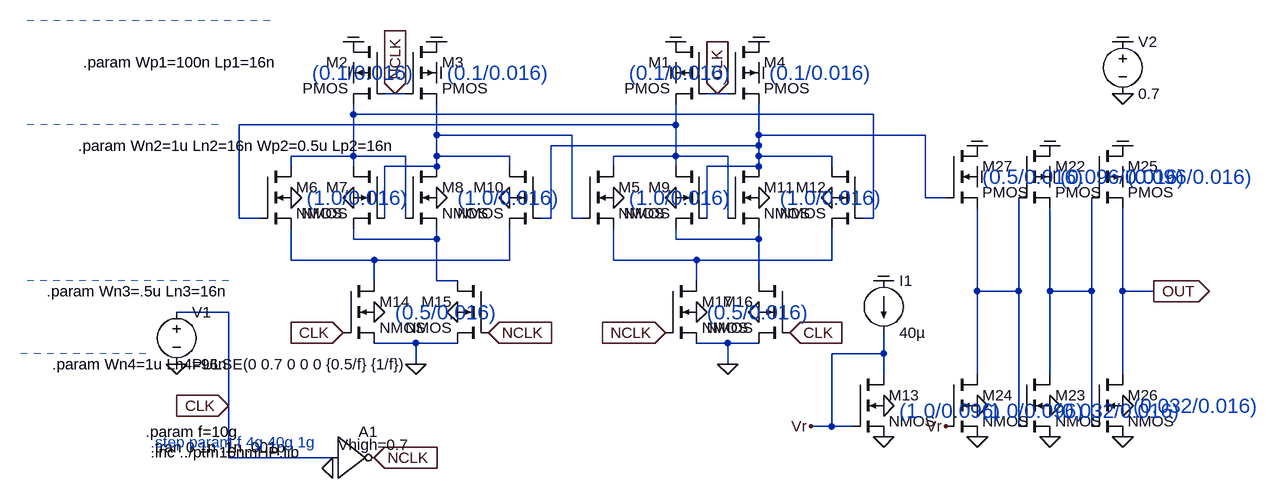
[diagram p0: schematic Wang_divide-by-2.asc]
Wang_divide-by-2.asc, the LTspice schematic file:
Version 4
SHEET 1 2320 1084
WIRE 1008 128 992 128
WIRE 1024 128 1008 128
WIRE 1504 128 1488 128
WIRE 1520 128 1504 128
WIRE 944 160 944 144
WIRE 1744 160 944 160
WIRE 1440 176 1440 144
WIRE 1440 176 768 176
WIRE 1072 192 1072 144
WIRE 1280 192 1072 192
WIRE 1568 192 1568 144
WIRE 1824 192 1568 192
WIRE 1568 208 1568 192
WIRE 1568 208 1248 208
WIRE 944 224 944 160
WIRE 944 224 848 224
WIRE 1024 224 944 224
WIRE 1072 224 1072 192
WIRE 1184 224 1072 224
WIRE 1440 224 1440 176
WIRE 1440 224 1344 224
WIRE 1520 224 1440 224
WIRE 1568 224 1568 208
WIRE 1680 224 1568 224
WIRE 848 240 848 224
WIRE 944 240 944 224
WIRE 1072 240 1072 224
WIRE 1072 240 992 240
WIRE 1184 240 1184 224
WIRE 1344 240 1344 224
WIRE 1440 240 1440 224
WIRE 1568 240 1568 224
WIRE 1568 240 1488 240
WIRE 1680 240 1680 224
WIRE 1824 288 1824 192
WIRE 1856 288 1824 288
WIRE 768 320 768 176
WIRE 800 320 768 320
WIRE 992 320 992 240
WIRE 1024 320 1024 224
WIRE 1248 320 1248 208
WIRE 1248 320 1232 320
WIRE 1280 320 1280 192
WIRE 1296 320 1280 320
WIRE 1488 320 1488 240
WIRE 1520 320 1520 224
WIRE 1744 320 1744 160
WIRE 1744 320 1728 320
WIRE 944 352 944 336
WIRE 1072 352 1072 336
WIRE 1072 352 944 352
WIRE 1440 352 1440 336
WIRE 1568 352 1568 336
WIRE 1568 352 1440 352
WIRE 848 384 848 336
WIRE 976 384 848 384
WIRE 1184 384 1184 336
WIRE 1184 384 976 384
WIRE 1344 384 1344 336
WIRE 1472 384 1344 384
WIRE 1680 384 1680 336
WIRE 1680 384 1472 384
WIRE 976 416 976 384
WIRE 1072 416 1072 352
WIRE 1104 416 1072 416
WIRE 1472 416 1472 384
WIRE 1568 416 1568 352
WIRE 1904 432 1904 304
WIRE 1968 432 1968 288
WIRE 1968 432 1904 432
WIRE 2016 432 2016 304
WIRE 2080 432 2080 288
WIRE 2080 432 2016 432
WIRE 2128 432 2128 304
WIRE 2176 432 2128 432
WIRE 752 464 672 464
WIRE 1040 512 976 512
WIRE 1104 512 1040 512
WIRE 1520 512 1472 512
WIRE 1568 512 1520 512
WIRE 1760 528 1760 496
WIRE 1760 528 1680 528
WIRE 1040 544 1040 512
WIRE 1520 544 1520 512
WIRE 1760 560 1760 528
WIRE 1904 560 1904 432
WIRE 2016 560 2016 432
WIRE 2128 560 2128 432
WIRE 752 608 752 464
WIRE 1680 640 1680 528
WIRE 1680 640 1648 640
WIRE 1712 640 1680 640
WIRE 1968 640 1968 432
WIRE 2080 640 2080 432
WIRE 752 688 752 608
WIRE 912 688 752 688
FLAG 976 464 0
FLAG 848 288 0
FLAG 944 288 0
FLAG 1072 288 0
FLAG 1184 288 0
FLAG 1072 96 COM
FLAG 1072 48 COM
FLAG 944 48 COM
FLAG 944 96 COM
FLAG 1472 464 0
FLAG 1344 288 0
FLAG 1440 288 0
FLAG 1568 288 0
FLAG 1680 288 0
FLAG 1568 96 COM
FLAG 1568 48 COM
FLAG 1440 48 COM
FLAG 1440 96 COM
FLAG 2128 128 0
FLAG 672 544 0
FLAG 2128 48 COM
FLAG 1760 656 0
FLAG 1760 608 0
FLAG 1648 640 Vr
FLAG 1760 416 COM
FLAG 1904 656 0
FLAG 1904 608 0
FLAG 1856 640 Vr
FLAG 1904 256 COM
FLAG 2016 656 0
FLAG 2016 608 0
FLAG 2016 208 COM
FLAG 2016 256 COM
FLAG 2128 656 0
FLAG 2128 608 0
FLAG 2128 208 COM
FLAG 2128 256 COM
FLAG 912 704 0
FLAG 1904 208 COM
FLAG 928 496 CLK
IOPIN 928 496 In
FLAG 1504 128 CLK
IOPIN 1504 128 In
FLAG 752 608 CLK
IOPIN 752 608 In
FLAG 1008 128 NCLK
IOPIN 1008 128 In
FLAG 1424 496 NCLK
IOPIN 1424 496 In
FLAG 976 688 NCLK
IOPIN 976 688 In
FLAG 1104 464 0
FLAG 1152 496 NCLK
IOPIN 1152 496 In
FLAG 1568 464 0
FLAG 1520 544 0
FLAG 1616 496 CLK
IOPIN 1616 496 In
FLAG 1040 544 0
FLAG 2176 432 OUT
IOPIN 2176 432 Out
SYMBOL pmos4 992 48 M0
SYMATTR InstName M2
SYMATTR Value2 l={Lp1} w={Wp1}
SYMBOL pmos4 1024 48 R0
SYMATTR InstName M3
SYMATTR Value2 l={Lp1} w={Wp1}
SYMBOL nmos4 800 240 R0
SYMATTR InstName M6
SYMATTR Value2 l={Ln2} w={Wn2}
SYMBOL nmos4 992 240 M0
SYMATTR InstName M7
SYMATTR Value2 l={Ln2} w={Wn2}
SYMBOL nmos4 1024 240 R0
SYMATTR InstName M8
SYMATTR Value2 l={Ln2} w={Wn2}
SYMBOL nmos4 1232 240 M0
SYMATTR InstName M10
SYMATTR Value2 l={Ln2} w={Wn2}
SYMBOL nmos4 928 416 R0
SYMATTR InstName M14
SYMATTR Value2 l={Ln3} w={Wn3}
SYMBOL pmos4 1488 48 M0
SYMATTR InstName M1
SYMATTR Value2 l={Lp1} w={Wp1}
SYMBOL pmos4 1520 48 R0
SYMATTR InstName M4
SYMATTR Value2 l={Lp1} w={Wp1}
SYMBOL nmos4 1296 240 R0
SYMATTR InstName M5
SYMATTR Value2 l={Ln2} w={Wn2}
SYMBOL nmos4 1488 240 M0
SYMATTR InstName M9
SYMATTR Value2 l={Ln2} w={Wn2}
SYMBOL nmos4 1520 240 R0
SYMATTR InstName M11
SYMATTR Value2 l={Ln2} w={Wn2}
SYMBOL nmos4 1728 240 M0
SYMATTR InstName M12
SYMATTR Value2 l={Ln2} w={Wn2}
SYMBOL nmos4 1424 416 R0
SYMATTR InstName M17
SYMATTR Value2 l={Ln3} w={Wn3}
SYMBOL voltage 672 448 R0
WINDOW 123 0 0 Left 0
WINDOW 39 0 0 Left 0
SYMATTR InstName V1
SYMATTR Value PULSE(0 0.7 0 0 0 {0.5/f} {1/f})
SYMBOL voltage 2128 32 R0
WINDOW 123 0 0 Left 0
WINDOW 39 0 0 Left 0
SYMATTR InstName V2
SYMATTR Value 0.7
SYMBOL current 1760 416 R0
WINDOW 123 0 0 Left 0
WINDOW 39 0 0 Left 0
SYMATTR InstName I1
SYMATTR Value 40µ
SYMBOL nmos4 1712 560 R0
SYMATTR InstName M13
SYMATTR Value2 l={Ln4} w={Wn4}
SYMBOL nmos4 1856 560 R0
SYMATTR InstName M24
SYMATTR Value2 l={Ln4} w={Wn4}
SYMBOL nmos4 1856 208 R0
SYMATTR InstName M27
SYMATTR Value PMOS
SYMATTR Value2 l={Lp2} w={Wp2}
SYMBOL pmos4 1968 208 R0
SYMATTR InstName M22
SYMATTR Value2 l=16n w=96n
SYMBOL nmos4 1968 560 R0
SYMATTR InstName M23
SYMATTR Value2 l=16n w=32n
SYMBOL pmos4 2080 208 R0
SYMATTR InstName M25
SYMATTR Value2 l=16n w=96n
SYMBOL nmos4 2080 560 R0
SYMATTR InstName M26
SYMATTR Value2 l=16n w=32n
SYMBOL Digital\\inv 912 624 R0
WINDOW 3 8 44 Left 2
SYMATTR Value Vhigh=0.7
SYMATTR InstName A1
SYMBOL nmos4 1152 416 M0
SYMATTR InstName M15
SYMATTR Value2 l={Ln3} w={Wn3}
SYMBOL nmos4 1616 416 M0
SYMATTR InstName M16
SYMATTR Value2 l={Ln3} w={Wn3}
TEXT 632 672 Left 2 !.tran 0 1n .1n .001p
TEXT 632 680 Left 2 !.inc ../ptm16nmHP.lib
TEXT 528 80 Left 2 !.param Wp1=100n Lp1=16n
TEXT 520 208 Left 2 !.param Wn2=1u Ln2=16n Wp2=0.5u Lp2=16n
TEXT 472 432 Left 2 !.param Wn3=.5u Ln3=16n
TEXT 480 544 Left 2 !.param Wn4=1u Ln4=96n
TEXT 624 648 Left 2 !.param f=10g
TEXT 880 96 Left 3 ;(0.1/0.016)
TEXT 1088 96 Left 3 ;(0.1/0.016)
TEXT 1368 96 Left 3 ;(0.1/0.016)
TEXT 1584 96 Left 3 ;(0.1/0.016)
TEXT 872 288 Left 3 ;(1.0/0.016)
TEXT 1104 288 Left 3 ;(1.0/0.016)
TEXT 1368 288 Left 3 ;(1.0/0.016)
TEXT 1600 288 Left 3 ;(1.0/0.016)
TEXT 1008 464 Left 3 ;(0.5/0.016)
TEXT 1488 464 Left 3 ;(0.5/0.016)
TEXT 1784 616 Left 3 ;(1.0/0.096)
TEXT 1912 616 Left 3 ;(1.0/0.096)
TEXT 1912 256 Left 3 ;(0.5/0.016)
TEXT 2032 256 Left 3 ;(0.096/0.016)
TEXT 2136 256 Left 3 ;(0.096/0.016)
TEXT 2144 608 Left 3 ;(0.032/0.016)
TEXT 2024 616 Left 3 ;(0.032/0.016)
TEXT 632 664 Left 2 ;.step param f 4g 40g 1g
LINE Normal 816 16 432 16 2
LINE Normal 736 176 432 176 2
LINE Normal 736 176 736 176 2
LINE Normal 752 416 432 416 2
LINE Normal 624 528 432 528 2

The netlist it stands for:
* Wang_divide-by-2.asc
M2 COM NCLK N001 COM PMOS l={Lp1} w={Wp1}
M3 COM NCLK N003 COM PMOS l={Lp1} w={Wp1}
M6 N001 N002 N007 0 NMOS l={Ln2} w={Wn2}
M7 N001 N003 N005 0 NMOS l={Ln2} w={Wn2}
M8 N003 N001 N005 0 NMOS l={Ln2} w={Wn2}
M10 N003 N004 N007 0 NMOS l={Ln2} w={Wn2}
M14 N007 CLK 0 0 NMOS l={Ln3} w={Wn3}
M1 COM CLK N002 COM PMOS l={Lp1} w={Wp1}
M4 COM CLK N004 COM PMOS l={Lp1} w={Wp1}
M5 N002 N003 N008 0 NMOS l={Ln2} w={Wn2}
M9 N002 N004 N006 0 NMOS l={Ln2} w={Wn2}
M11 N004 N002 N006 0 NMOS l={Ln2} w={Wn2}
M12 N004 N001 N008 0 NMOS l={Ln2} w={Wn2}
M17 N008 NCLK 0 0 NMOS l={Ln3} w={Wn3}
V1 CLK 0 PULSE(0 0.7 0 0 0 {0.5/f} {1/f})
V2 COM 0 0.7
I1 COM Vr 40µ
M13 Vr Vr 0 0 NMOS l={Ln4} w={Wn4}
M24 N009 Vr 0 0 NMOS l={Ln4} w={Wn4}
M27 COM N004 N009 COM PMOS l={Lp2} w={Wp2}
M22 COM N009 N010 COM PMOS l=16n w=96n
M23 N010 N009 0 0 NMOS l=16n w=32n
M25 COM N010 OUT COM PMOS l=16n w=96n
M26 OUT N010 0 0 NMOS l=16n w=32n
A1 CLK 0 0 0 0 NCLK 0 0 BUF Vhigh=0.7
M15 N005 NCLK 0 0 NMOS l={Ln3} w={Wn3}
M16 N006 CLK 0 0 NMOS l={Ln3} w={Wn3}
.model NMOS NMOS
.model PMOS PMOS
.lib standard.mos
.tran 0 1n .1n .001p
.inc ../ptm16nmHP.lib
.param Wp1=100n Lp1=16n
.param Wn2=1u Ln2=16n Wp2=0.5u Lp2=16n
.param Wn3=.5u Ln3=16n
.param Wn4=1u Ln4=96n
.param f=10g
* (0.1/0.016)
* (0.1/0.016)
* (0.1/0.016)
* (0.1/0.016)
* (1.0/0.016)
* (1.0/0.016)
* (1.0/0.016)
* (1.0/0.016)
* (0.5/0.016)
* (0.5/0.016)
* (1.0/0.096)
* (1.0/0.096)
* (0.5/0.016)
* (0.096/0.016)
* (0.096/0.016)
* (0.032/0.016)
* (0.032/0.016)
* .step param f 4g 40g 1g
.backanno
.end